# EAGLE schematic micro_led (EAGLE 9.0.1)
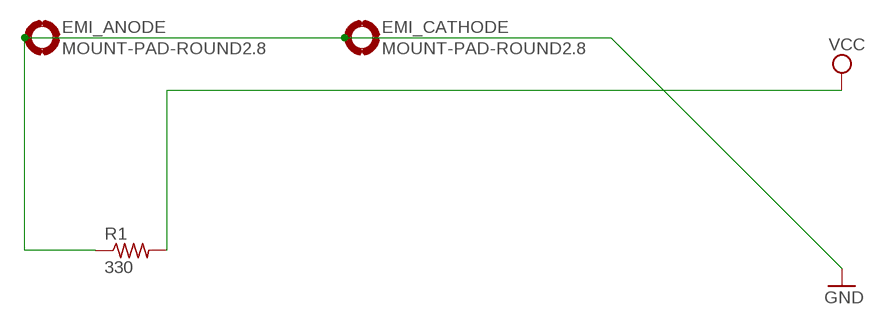
[diagram p0: schematic, sheet 1]

## Parts
EMI_ANODE  MOUNT-PAD-ROUND2.8  [2,8-PAD]
EMI_CATHODE  MOUNT-PAD-ROUND2.8  [2,8-PAD]
R1  330  R-US_0204/2V  [0204V]

## Nets
GND: EMI_ANODE.B2,8(MOUNT) EMI_CATHODE.B2,8(MOUNT) R1.1
VCC: R1.2

## Library data of the parts
EMI_ANODE EMI_CATHODE = holes:MOUNT-PAD-ROUND: MOUNTING PAD, round
R1 = rcl:R-US_: RESISTOR, American symbol; SPICEPREFIX: R